# EAGLE schematic tigor_mbed_rev_b_print (EAGLE 6.3)
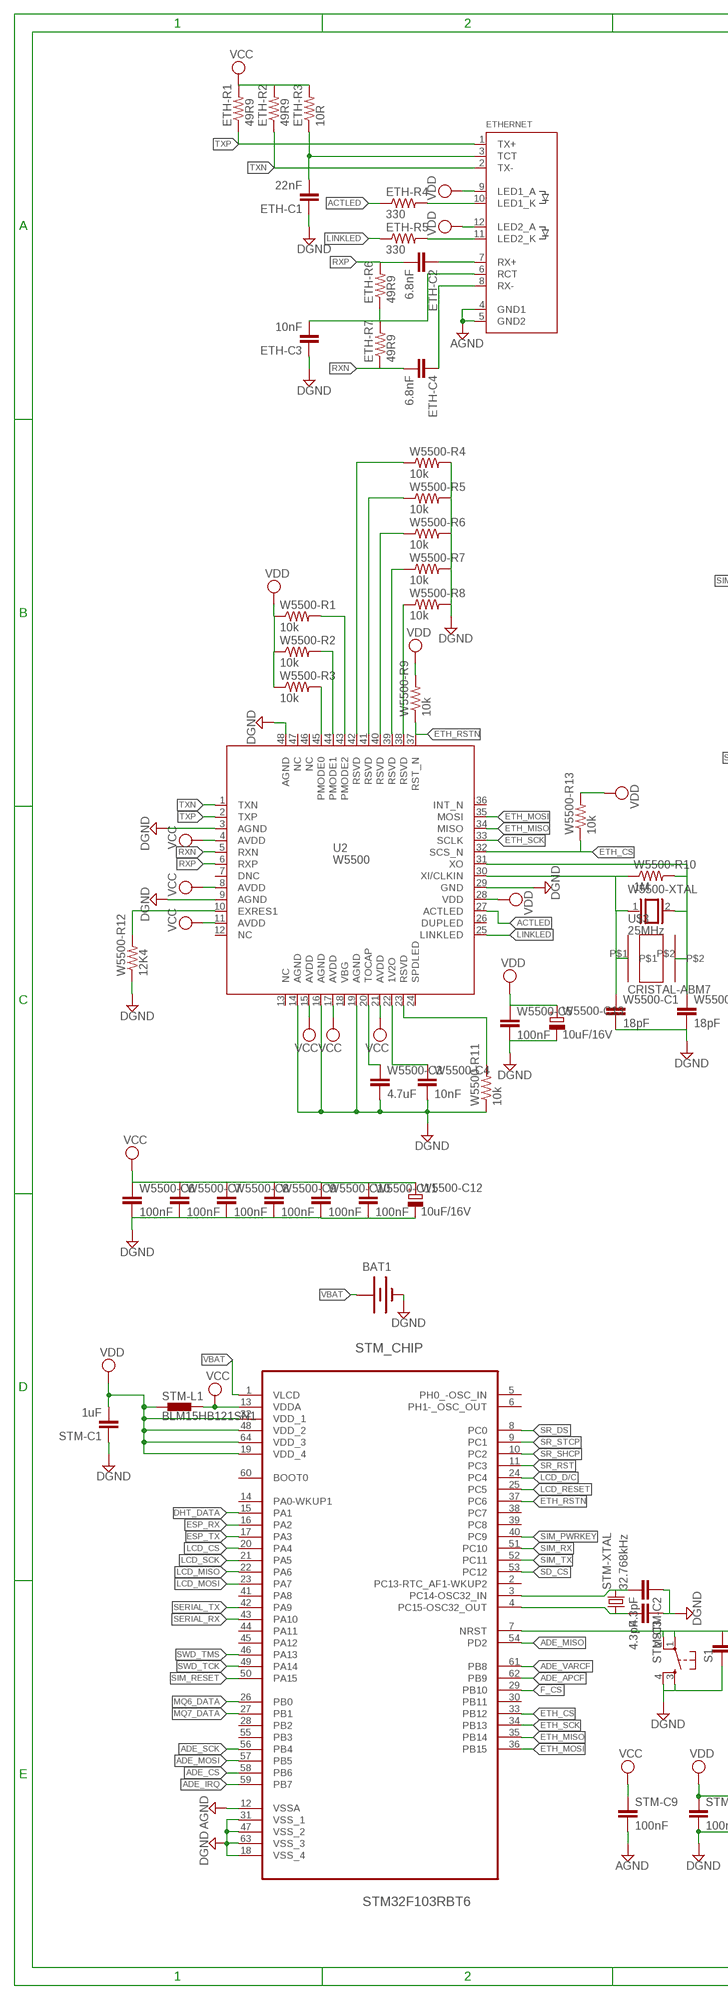
[diagram p0: schematic, sheet 1, part 1 of 2]
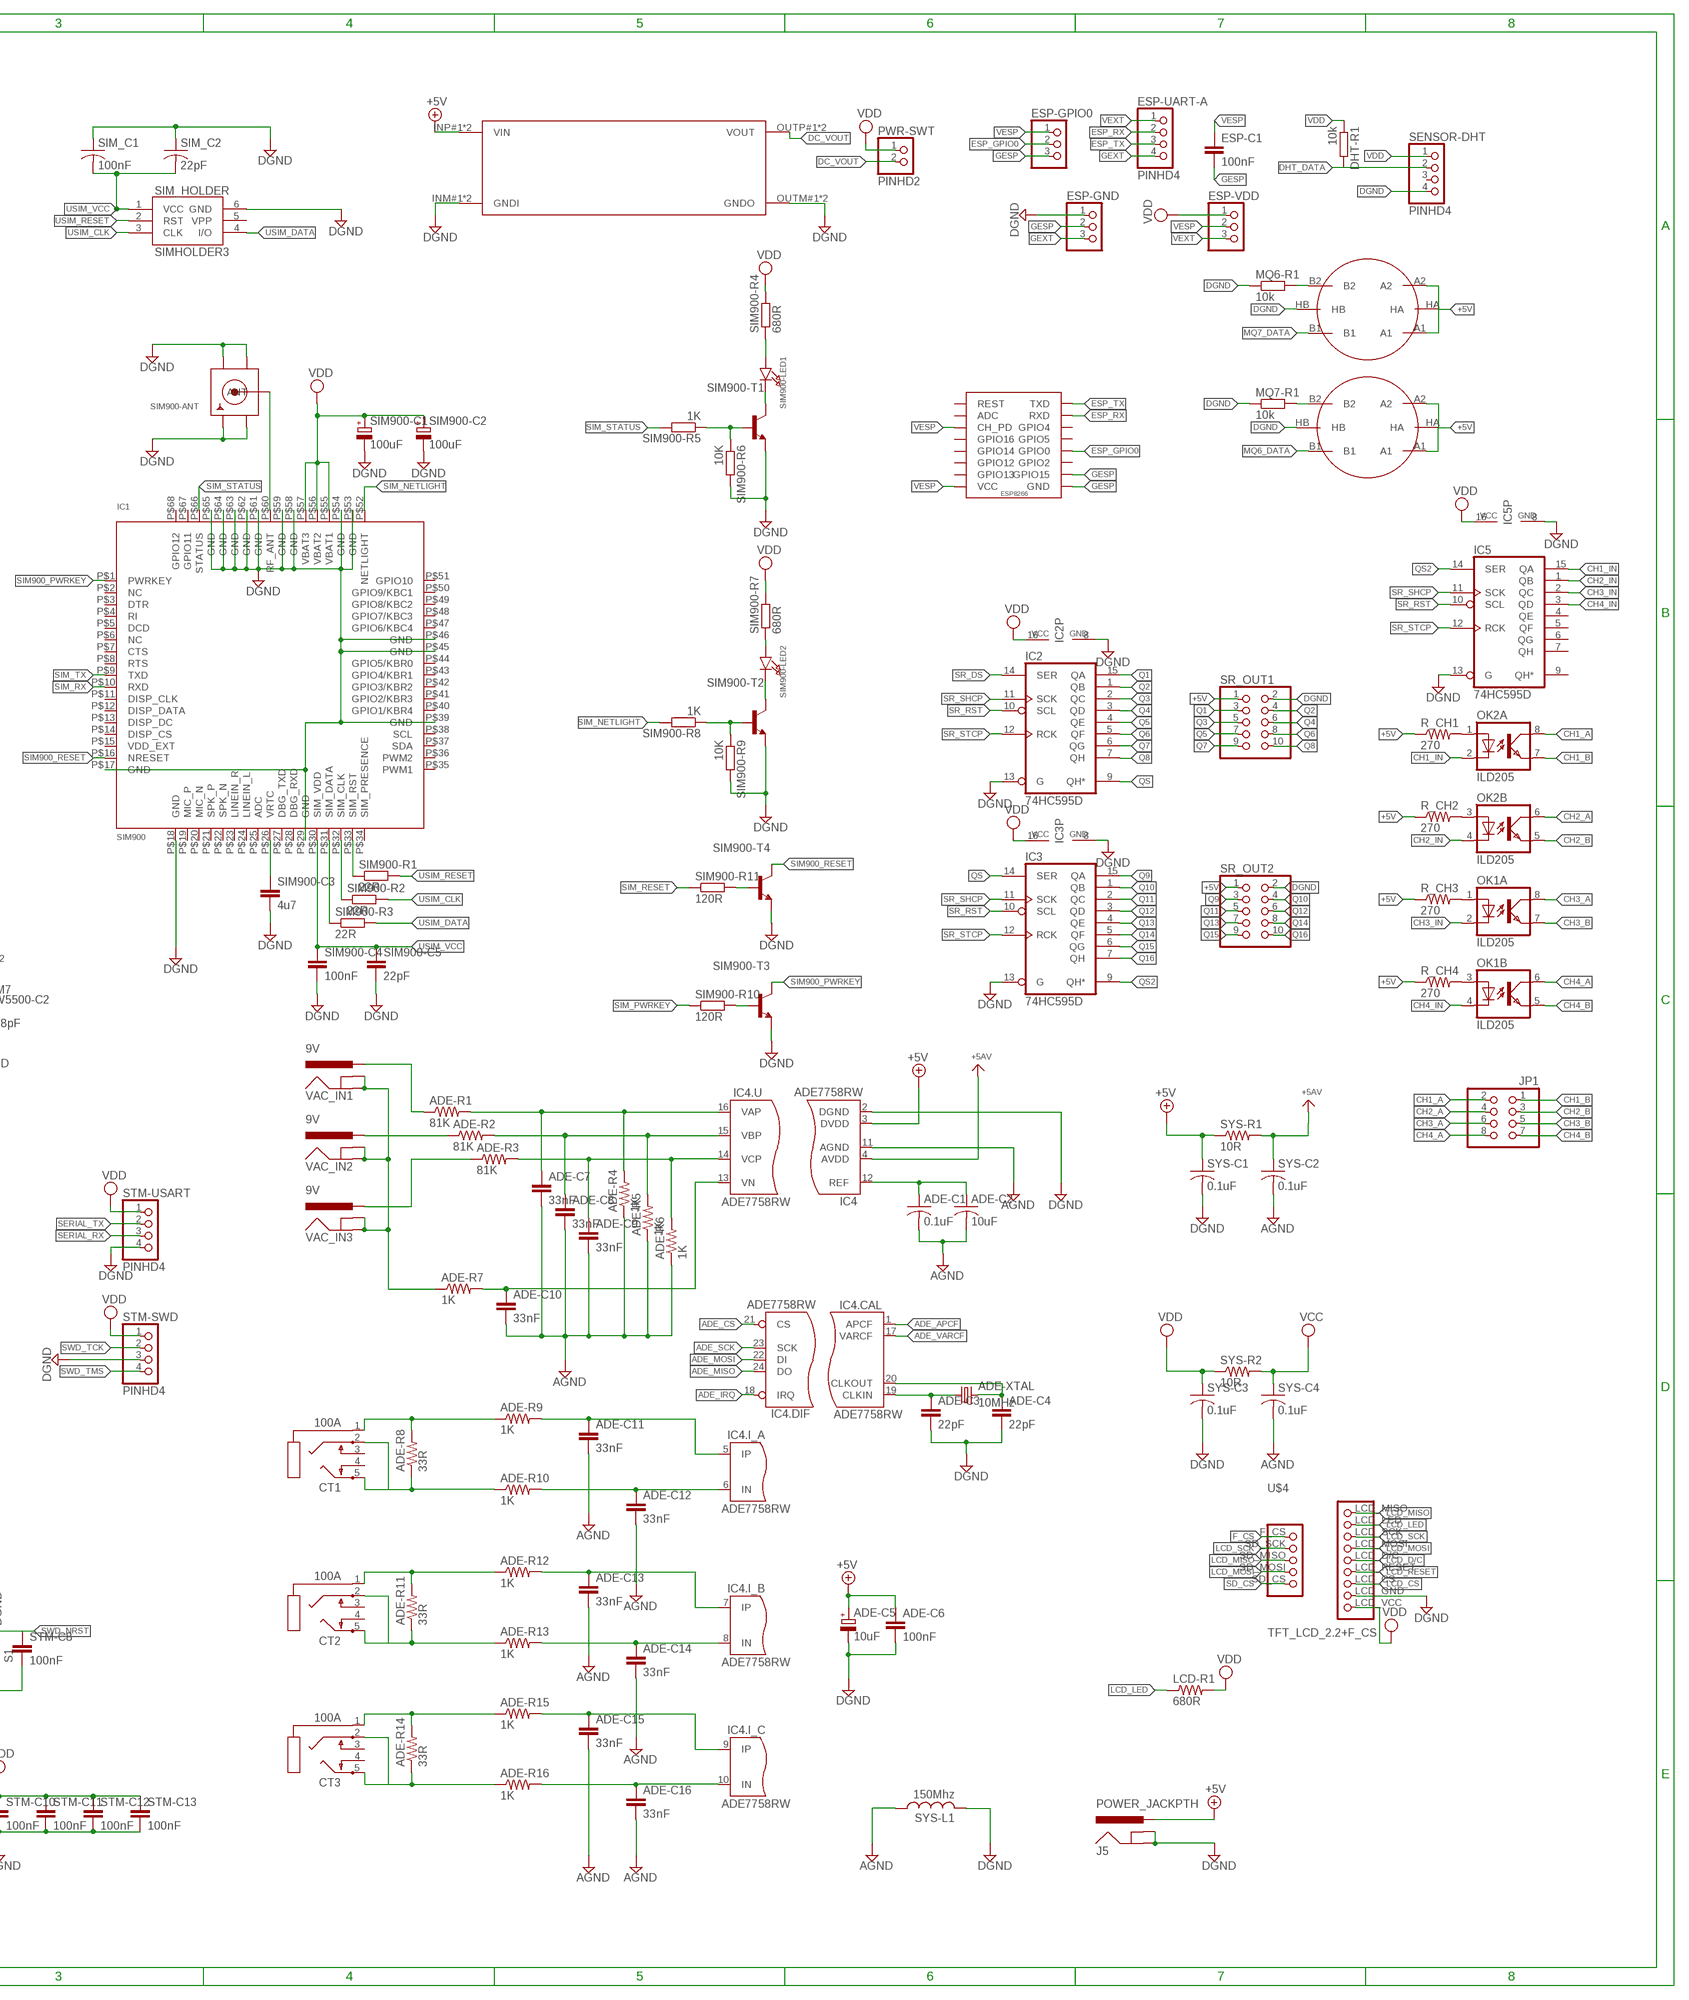
[diagram p1: schematic, sheet 1, part 2 of 2]

## Parts
ADE-C1  0.1uF  C-USC0603  [C0603@1]
ADE-C2  10uF  C-USC0805K  [C0805K]
ADE-C3  22pF  C-EUC0603  [C0603]
ADE-C4  22pF  C-EUC0603  [C0603]
ADE-C5  10uF  CPOL-EU153CLV-0605  [153CLV-0605]
ADE-C6  100nF  C-EUC0603  [C0603]
ADE-C7  33nF  CAP0603-CAP  [0603-CAP]
ADE-C8  33nF  CAP0603-CAP  [0603-CAP]
ADE-C9  33nF  CAP0603-CAP  [0603-CAP]
ADE-C10  33nF  CAP0603-CAP  [0603-CAP]
ADE-C11  33nF  CAP0603-CAP  [0603-CAP]
ADE-C12  33nF  CAP0603-CAP  [0603-CAP]
ADE-C13  33nF  CAP0603-CAP  [0603-CAP]
ADE-C14  33nF  CAP0603-CAP  [0603-CAP]
ADE-C15  33nF  CAP0603-CAP  [0603-CAP]
ADE-C16  33nF  CAP0603-CAP  [0603-CAP]
ADE-R1  81K  RESISTOR0603-RES  [0603-RES]
ADE-R2  81K  RESISTOR0603-RES  [0603-RES]
ADE-R3  81K  RESISTOR0603-RES  [0603-RES]
ADE-R4  1K  RESISTOR0603-RES  [0603-RES]
ADE-R5  1K  RESISTOR0603-RES  [0603-RES]
ADE-R6  1K  RESISTOR0603-RES  [0603-RES]
ADE-R7  1K  RESISTOR0603-RES  [0603-RES]
ADE-R8  33R  RESISTOR0603-RES  [0603-RES]
ADE-R9  1K  RESISTOR0603-RES  [0603-RES]
ADE-R10  1K  RESISTOR0603-RES  [0603-RES]
ADE-R11  33R  RESISTOR0603-RES  [0603-RES]
ADE-R12  1K  RESISTOR0603-RES  [0603-RES]
ADE-R13  1K  RESISTOR0603-RES  [0603-RES]
ADE-R14  33R  RESISTOR0603-RES  [0603-RES]
ADE-R15  1K  RESISTOR0603-RES  [0603-RES]
ADE-R16  1K  RESISTOR0603-RES  [0603-RES]
ADE-XTAL  10MHz  CRYSTALHC49US  [HC49US]
BAT1  BATTERY20PTH  [BATTCOM_20MM_PTH]
CT1  100A  AUDIO_STEREOJACK  [STX3100]
CT2  100A  AUDIO_STEREOJACK  [STX3100]
CT3  100A  AUDIO_STEREOJACK  [STX3100]
DCDC-3.5V  DCDCMODULE_SMALL  [DCDCMODULE-SMALL]
DHT-R1  10k  R-EU_R0603  [R0603]
ESP-C1  100nF  C-EUC0603  [C0603]
ESP-GND  PINHD-1X3  [1X03]
ESP-GPIO0  PINHD-1X3  [1X03]
ESP-UART-A  PINHD4  [PINHD4]
ESP-VDD  PINHD-1X3  [1X03]
ETH-C1  22nF  C-EUC0603  [C0603]
ETH-C2  6.8nF  C-EUC0603  [C0603]
ETH-C3  10nF  C-EUC0603  [C0603]
ETH-C4  6.8nF  C-EUC0603  [C0603]
ETH-R1  49R9  R-US_R0603  [R0603]
ETH-R2  49R9  R-US_R0603  [R0603]
ETH-R3  10R  R-US_R0603  [R0603]
ETH-R4  330  R-US_R0603  [R0603]
ETH-R5  330  R-US_R0603  [R0603]
ETH-R6  49R9  R-US_R0603  [R0603]
ETH-R7  49R9  R-US_R0603  [R0603]
ETHERNET  RJ45J0026D21BNL  [RJ45_PULSEJACK]
IC1  SIM900  GSM_SIM900_LITERAL  [SIM900_SMT]
IC2  74HC595D  [SO16]
IC3  74HC595D  [SO16]
IC4  ADE7758RW  [SOIC24]
IC5  74HC595D  [SO16]
J5  POWER_JACKPTH  [POWER_JACK_PTH]
JP1  PINHD-2X4  [2X04]
LCD-R1  680R  RESISTOR0603-RES  [0603-RES]
MQ6-R1  10k  R-EU_R0603  [R0603]
MQ7-R1  10k  R-EU_R0603  [R0603]
OK1  ILD205  [SOIC08]
OK2  ILD205  [SOIC08]
PWR-SWT  PINHD2  [PINHD2]
R_CH1  270  RESISTOR0603-RES  [0603-RES]
R_CH2  270  RESISTOR0603-RES  [0603-RES]
R_CH3  270  RESISTOR0603-RES  [0603-RES]
R_CH4  270  RESISTOR0603-RES  [0603-RES]
S1  TAC_SWITCHPTH  [TACTILE-PTH]
SENSOR-DHT  PINHD4  [PINHD4]
SENSOR-MQ6  METHANE_SENSOR  [MQ-3]
SENSOR-MQ7  METHANE_SENSOR  [MQ-3]
SIM900-ANT  SMACONNECTOR  [SMA90_DIP]
SIM900-C1  100uF  CPOL-EU153CLV-0605  [153CLV-0605]
SIM900-C2  100uF  CPOL-EU153CLV-0605  [153CLV-0605]
SIM900-C3  4u7  C-EUC0603  [C0603]
SIM900-C4  100nF  C-EUC0603  [C0603]
SIM900-C5  22pF  C-EUC0603  [C0603]
SIM900-LED1  LED0805_NOOUTLINE  [CHIPLED_0805_NOOUTLINE]
SIM900-LED2  LED0805_NOOUTLINE  [CHIPLED_0805_NOOUTLINE]
SIM900-R1  22R  R-EU_R0603  [R0603]
SIM900-R2  22R  R-EU_R0603  [R0603]
SIM900-R3  22R  R-EU_R0603  [R0603]
SIM900-R4  680R  R-EU_R0603  [R0603]
SIM900-R5  1K  R-EU_R0603  [R0603]
SIM900-R6  10K  R-EU_R0603  [R0603]
SIM900-R7  680R  R-EU_R0603  [R0603]
SIM900-R8  1K  R-EU_R0603  [R0603]
SIM900-R9  10K  R-EU_R0603  [R0603]
SIM900-R10  120R  R-EU_R0603  [R0603]
SIM900-R11  120R  R-EU_R0603  [R0603]
SIM900-T1  MMBT2222ALT1-NPN-SOT23-BEC  [SOT23-BEC]
SIM900-T2  MMBT2222ALT1-NPN-SOT23-BEC  [SOT23-BEC]
SIM900-T3  MMBT2222ALT1-NPN-SOT23-BEC  [SOT23-BEC]
SIM900-T4  MMBT2222ALT1-NPN-SOT23-BEC  [SOT23-BEC]
SIM_C1  100nF  C-USC0603K  [C0603K]
SIM_C2  22pF  C-USC0603K  [C0603K]
SIM_HOLDER  SIMHOLDER3  [SIMHOLDER3]
SR_OUT1  PINHD-2X5/90  [2X05/90]
SR_OUT2  PINHD-2X5/90  [2X05/90]
STM-C1  1uF  C-EUC0603  [C0603]
STM-C2  4.3pF  C-EUC0603  [C0603]
STM-C3  4.3pF  C-EUC0603  [C0603]
STM-C8  100nF  C-EUC0603  [C0603]
STM-C9  100nF  C-EUC0603  [C0603]
STM-C10  100nF  C-EUC0603  [C0603]
STM-C11  100nF  C-EUC0603  [C0603]
STM-C12  100nF  C-EUC0603  [C0603]
STM-C13  100nF  C-EUC0603  [C0603]
STM-L1  BLM15HB121SN1  [0402]
STM-SWD  PINHD4  [PINHD4]
STM-USART  PINHD4  [PINHD4]
STM-XTAL  32.768kHz  CRYSTALTC26H  [TC26H]
STM_CHIP  STM32F103RBT6  STM32L152RBT6  [QFP50P1200X1200X160-64N]
SYS-C1  0.1uF  C-USC0603  [C0603@1]
SYS-C2  0.1uF  C-USC0603  [C0603@1]
SYS-C3  0.1uF  C-USC0603  [C0603@1]
SYS-C4  0.1uF  C-USC0603  [C0603@1]
SYS-L1  150Mhz  L-USWE-TPC  [POWER-CHOKE_WE-TPC]
SYS-R1  10R  RESISTOR0603-RES  [0603-RES]
SYS-R2  10R  RESISTOR0603-RES  [0603-RES]
U2  W5500  [W5500]
U$3  CRISTAL-ABM7  [CRISTAL-ABM7]
U$4  TFT_LCD_2.2+F_CS  [TFT_LCD_2.2+F_CS]
U$5  ESP8266WI12  [WI12]
VAC_IN1  9V  POWER_JACKPTH  [POWER_JACK_PTH]
VAC_IN2  9V  POWER_JACKPTH  [POWER_JACK_PTH]
VAC_IN3  9V  POWER_JACKPTH  [POWER_JACK_PTH]
W5500-C1  18pF  C-EUC0603  [C0603]
W5500-C2  18pF  C-EUC0603  [C0603]
W5500-C3  4.7uF  C-EUC0603  [C0603]
W5500-C4  10nF  C-EUC0603  [C0603]
W5500-C5  100nF  C-EUC0603  [C0603]
W5500-C6  100nF  C-EUC0603  [C0603]
W5500-C7  100nF  C-EUC0603  [C0603]
W5500-C8  100nF  C-EUC0603  [C0603]
W5500-C9  100nF  C-EUC0603  [C0603]
W5500-C10  100nF  C-EUC0603  [C0603]
W5500-C11  100nF  C-EUC0603  [C0603]
W5500-C12  10uF/16V  CPOL-EU153CLV-0605  [153CLV-0605]
W5500-C13  10uF/16V  CPOL-EU153CLV-0605  [153CLV-0605]
W5500-R1  10k  R-US_R0603  [R0603]
W5500-R2  10k  R-US_R0603  [R0603]
W5500-R3  10k  R-US_R0603  [R0603]
W5500-R4  10k  R-US_R0603  [R0603]
W5500-R5  10k  R-US_R0603  [R0603]
W5500-R6  10k  R-US_R0603  [R0603]
W5500-R7  10k  R-US_R0603  [R0603]
W5500-R8  10k  R-US_R0603  [R0603]
W5500-R9  10k  R-US_R0603  [R0603]
W5500-R10  1M  R-US_R0603  [R0603]
W5500-R11  10k  R-US_R0603  [R0603]
W5500-R12  12K4  R-US_R0805  [R0805]
W5500-R13  10k  R-US_R0603  [R0603]
W5500-XTAL  25MHz  XTAL/S  [QS]

## Nets
+5V [power]: ADE-C5.+ ADE-C6.1 DCDC-3.5V.INP#1(VIN) DCDC-3.5V.INP#2(VIN) IC4.3(DVDD) J5.PWR R_CH1.1 R_CH2.1 R_CH3.1 R_CH4.1 SENSOR-MQ6.A1 SENSOR-MQ6.A2 SENSOR-MQ6.HA SENSOR-MQ7.A1 SENSOR-MQ7.A2 SENSOR-MQ7.HA SR_OUT1.1 SR_OUT2.1 SYS-C1.1 SYS-R1.1
ACTLED: ETH-R4.1 U2.27(ACTLED)
ADE_APCF: IC4.1(APCF) STM_CHIP.62(PB9)
ADE_CS: IC4.21(CS) STM_CHIP.58(PB6)
ADE_IRQ: IC4.18(IRQ) STM_CHIP.59(PB7)
ADE_MISO: IC4.24(DO) STM_CHIP.54(PD2)
ADE_MOSI: IC4.22(DI) STM_CHIP.57(PB5)
ADE_SCK: IC4.23(SCK) STM_CHIP.56(PB4)
ADE_VARCF: IC4.17(VARCF) STM_CHIP.61(PB8)
AGND: ADE-C1.2 ADE-C2.2 ADE-C7.2 ADE-C8.2 ADE-C9.2 ADE-C10.2 ADE-C11.2 ADE-C12.2 ADE-C13.2 ADE-C14.2 ADE-C15.2 ADE-C16.2 ADE-R4.1 ADE-R5.1 ADE-R6.1 ETHERNET.4(GND1) ETHERNET.5(GND2) IC4.11(AGND) STM-C9.2 STM_CHIP.12(VSSA) SYS-C2.2 SYS-C4.2 SYS-L1.1
AVDD: IC4.4(AVDD) SYS-C2.1 SYS-R1.2 ; supply symbol labelled +5AV
CH1_A: JP1.2 OK2.8(A:COL)
CH1_B: JP1.1 OK2.7(A:EMIT)
CH1_IN: IC5.15(QA) OK2.2(A:C)
CH2_A: JP1.4 OK2.6(B:COL)
CH2_B: JP1.3 OK2.5(B:EMIT)
CH2_IN: IC5.1(QB) OK2.4(B:C)
CH3_A: JP1.6 OK1.8(A:COL)
CH3_B: JP1.5 OK1.7(A:EMIT)
CH3_IN: IC5.2(QC) OK1.2(A:C)
CH4_A: JP1.8 OK1.6(B:COL)
CH4_B: JP1.7 OK1.5(B:EMIT)
CH4_IN: IC5.3(QD) OK1.4(B:C)
DC_VOUT: DCDC-3.5V.OUTP#1(VOUT) DCDC-3.5V.OUTP#2(VOUT) PWR-SWT.2
DGND: ADE-C3.2 ADE-C4.2 ADE-C5.- ADE-C6.2 BAT1.2(-) DCDC-3.5V.INM#1(GNDI) DCDC-3.5V.INM#2(GNDI) DCDC-3.5V.OUTM#1(GNDO) DCDC-3.5V.OUTM#2(GNDO) ESP-GND.1 ETH-C1.1 ETH-C3.1 IC1.P$17(GND) IC1.P$18(GND) IC1.P$29(GND) IC1.P$39(GND) IC1.P$45(GND) IC1.P$46(GND) IC1.P$53(GND) IC1.P$54(GND) IC1.P$58(GND) IC1.P$59(GND) IC1.P$61(GND) IC1.P$62(GND) IC1.P$63(GND) IC1.P$64(GND) IC1.P$65(GND) IC2.8(GND) IC2.13(G) IC3.8(GND) IC3.13(G) IC4.2(DGND) IC5.8(GND) IC5.13(G) J5.GND J5.GNDBREAK MQ6-R1.1 MQ7-R1.1 S1.3 S1.4 SENSOR-DHT.4 SENSOR-MQ6.HB SENSOR-MQ7.HB SIM900-ANT.GND1 SIM900-ANT.GND2 SIM900-ANT.GND3 SIM900-ANT.GND4 SIM900-C1.- SIM900-C2.- SIM900-C3.2 SIM900-C4.2 SIM900-C5.2 SIM900-R6.2 SIM900-R9.2 SIM900-T1.E SIM900-T2.E SIM900-T3.E SIM900-T4.E SIM_C1.1 SIM_C2.1 SIM_HOLDER.6(GND) SR_OUT1.2 SR_OUT2.2 STM-C1.1 STM-C2.1 STM-C3.1 STM-C8.2 STM-C10.2 STM-C11.2 STM-C12.2 STM-C13.2 STM-SWD.3 STM-USART.4 STM_CHIP.18(VSS_4) STM_CHIP.31(VSS_1) STM_CHIP.47(VSS_2) STM_CHIP.63(VSS_3) SYS-C1.2 SYS-C3.2 SYS-L1.2 U2.3(AGND) U2.9(AGND) U2.14(AGND) U2.16(AGND) U2.19(AGND) U2.29(GND) U2.48(AGND) U$4.LCD_GND W5500-C1.2 W5500-C2.2 W5500-C3.2 W5500-C4.2 W5500-C5.2 W5500-C6.2 W5500-C7.2 W5500-C8.2 W5500-C9.2 W5500-C10.2 W5500-C11.2 W5500-C12.- W5500-C13.- W5500-R4.2 W5500-R5.2 W5500-R6.2 W5500-R7.2 W5500-R8.2 W5500-R11.1 W5500-R12.1
DHT_DATA: DHT-R1.2 SENSOR-DHT.2 STM_CHIP.15(PA1)
ESP_GPIO0: ESP-GPIO0.2 U$5.GPIO00(GPIO0)
ESP_RX: ESP-UART-A.2 STM_CHIP.16(PA2) U$5.RXD
ESP_TX: ESP-UART-A.3 STM_CHIP.17(PA3) U$5.TXD
ETH_CS: STM_CHIP.33(PB12) U2.32(SCS_N) W5500-R13.1
ETH_MISO: STM_CHIP.35(PB14) U2.34(MISO)
ETH_MOSI: STM_CHIP.36(PB15) U2.35(MOSI)
ETH_RSTN: STM_CHIP.37(PC6) U2.37(RST_N) W5500-R9.1
ETH_SCK: STM_CHIP.34(PB13) U2.33(SCLK)
F_CS: STM_CHIP.29(PB10) U$4.F_CS
GESP: ESP-C1.2 ESP-GND.2 ESP-GPIO0.3 U$5.GND U$5.GPIO15
GEXT: ESP-GND.3 ESP-UART-A.4
IBN: ADE-R11.1 ADE-R13.1 CT2.2 CT2.5
ICN: ADE-R14.1 ADE-R16.1 CT3.2 CT3.5
LCD_CS: STM_CHIP.20(PA4) U$4.LCD_CS
LCD_D/C: STM_CHIP.24(PC4) U$4.LCD_D/C
LCD_LED: LCD-R1.1 U$4.LCD_LED
LCD_MISO: STM_CHIP.22(PA6) U$4.LCD_MISO U$4.SD_MISO
LCD_MOSI: STM_CHIP.23(PA7) U$4.LCD_MOSI U$4.SD_MOSI
LCD_RESET: STM_CHIP.25(PC5) U$4.LCD_RESET
LCD_SCK: STM_CHIP.21(PA5) U$4.LCD_SCK U$4.SD_SCK
LINKLED: ETH-R5.1 U2.25(LINKLED)
MQ6_DATA: SENSOR-MQ7.B1 STM_CHIP.26(PB0)
MQ7_DATA: SENSOR-MQ6.B1 STM_CHIP.27(PB1)
N$1: STM-C2.2 STM-XTAL.2 STM_CHIP.3(PC14-OSC32_IN)
N$2: STM-C3.2 STM-XTAL.1 STM_CHIP.4(PC15-OSC32_OUT)
N$3: IC1.P$31(SIM_DATA) SIM900-R3.1
N$5: OK2.1(A:A) R_CH1.2
N$6: OK2.3(B:A) R_CH2.2
N$7: OK1.1(A:A) R_CH3.2
N$8: IC1.P$32(SIM_CLK) SIM900-R2.1
N$9: MQ6-R1.2 SENSOR-MQ6.B2
N$10: ADE-C9.1 ADE-R3.2 ADE-R6.2 IC4.14(VCP)
N$11: ETH-R4.2 ETHERNET.10(LED1_K)
N$12: ETH-R5.2 ETHERNET.11(LED2_K)
N$13: IC1.P$33(SIM_RST) SIM900-R1.1
N$14: IC1.P$26(VRTC) SIM900-C3.1
N$15: IC1.P$60(RF_ANT) SIM900-ANT.ANTENNA(ANT)
N$16: SIM900-LED1.A SIM900-R4.1
N$17: SIM900-LED1.C SIM900-T1.C
N$18: SIM900-R5.1 SIM900-R6.1 SIM900-T1.B
N$19: SIM900-LED2.A SIM900-R7.1
N$20: SIM900-LED2.C SIM900-T2.C
N$21: SIM900-R8.1 SIM900-R9.1 SIM900-T2.B
N$22: ETH-C2.1 ETHERNET.7(RX+)
N$23: ETH-C1.2 ETH-R3.1 ETHERNET.3(TCT)
N$24: ADE-C15.1 ADE-R15.2 IC4.9(IP)
N$25: ADE-R11.2 ADE-R12.1 CT2.1
N$26: ETH-C4.1 ETHERNET.8(RX-)
N$27: ADE-C11.1 ADE-R9.2 IC4.5(IP)
N$28: ADE-C12.1 ADE-R10.2 IC4.6(IN)
N$29: ETH-C3.2 ETH-R6.1 ETH-R7.2 ETHERNET.6(RCT)
N$30: ADE-C14.1 ADE-R13.2 IC4.8(IN)
N$31: ADE-C13.1 ADE-R12.2 IC4.7(IP)
N$32: ADE-C1.1 ADE-C2.1 IC4.12(REF)
N$33: ADE-C3.1 ADE-XTAL.1 IC4.19(CLKIN)
N$34: ADE-C4.1 ADE-XTAL.2 IC4.20(CLKOUT)
N$35: ADE-C10.1 ADE-R7.2 IC4.13(VN)
N$36: ADE-R2.1 VAC_IN2.PWR
N$37: ADE-C8.1 ADE-R2.2 ADE-R5.2 IC4.15(VBP)
N$38: U2.20(TOCAP) W5500-C3.1
N$39: ADE-R8.2 ADE-R9.1 CT1.1
N$40: ADE-C16.1 ADE-R16.2 IC4.10(IN)
N$41: U2.22(1V2O) W5500-C4.1
N$42: U2.23(RSVD) W5500-R11.2
N$43: MQ7-R1.2 SENSOR-MQ7.B2
N$44: SIM900-R10.2 SIM900-T3.B
N$45: SIM900-R11.2 SIM900-T4.B
N$46: OK1.3(B:A) R_CH4.2
N$47: ADE-R8.1 ADE-R10.1 CT1.2 CT1.5
N$48: ADE-R14.2 ADE-R15.1 CT3.1
N$50: U2.31(XO) U$3.P$2 W5500-C2.1 W5500-R10.2 W5500-XTAL.2
N$51: U2.10(EXRES1) W5500-R12.2
N$52: ADE-C7.1 ADE-R1.2 ADE-R4.2 IC4.16(VAP)
N$54: ADE-R1.1 VAC_IN1.PWR
N$55: ADE-R7.1 VAC_IN1.GND VAC_IN1.GNDBREAK VAC_IN2.GND VAC_IN2.GNDBREAK VAC_IN3.GND VAC_IN3.GNDBREAK
N$57: U2.38(RSVD) W5500-R8.1
N$58: U2.39(RSVD) W5500-R7.1
N$59: U2.40(RSVD) W5500-R6.1
N$60: U2.41(RSVD) W5500-R5.1
N$61: U2.42(RSVD) W5500-R4.1
N$62: U2.43(PMODE2) W5500-R1.2
N$63: U2.44(PMODE1) W5500-R2.2
N$64: U2.45(PMODE0) W5500-R3.2
N$65: ADE-R3.1 VAC_IN3.PWR
N$66: U2.30(XI/CLKIN) U$3.P$1 W5500-C1.1 W5500-R10.1 W5500-XTAL.1
Q1: IC2.15(QA) SR_OUT1.3
Q2: IC2.1(QB) SR_OUT1.4
Q3: IC2.2(QC) SR_OUT1.5
Q4: IC2.3(QD) SR_OUT1.6
Q5: IC2.4(QE) SR_OUT1.7
Q6: IC2.5(QF) SR_OUT1.8
Q7: IC2.6(QG) SR_OUT1.9
Q8: IC2.7(QH) SR_OUT1.10
Q9: IC3.15(QA) SR_OUT2.3
Q10: IC3.1(QB) SR_OUT2.4
Q11: IC3.2(QC) SR_OUT2.5
Q12: IC3.3(QD) SR_OUT2.6
Q13: IC3.4(QE) SR_OUT2.7
Q14: IC3.5(QF) SR_OUT2.8
Q15: IC3.6(QG) SR_OUT2.9
Q16: IC3.7(QH) SR_OUT2.10
QS: IC2.9(QH*) IC3.14(SER)
QS2: IC3.9(QH*) IC5.14(SER)
RXN: ETH-C4.2 ETH-R7.1 U2.5(RXN)
RXP: ETH-C2.2 ETH-R6.2 U2.6(RXP)
SD_CS: STM_CHIP.53(PC12) U$4.SD_CS
SERIAL_RX: STM-USART.3 STM_CHIP.43(PA10)
SERIAL_TX: STM-USART.2 STM_CHIP.42(PA9)
SIM900_PWRKEY: IC1.P$1(PWRKEY) SIM900-T3.C
SIM900_RESET: IC1.P$16(NRESET) SIM900-T4.C
SIM_NETLIGHT: IC1.P$52(NETLIGHT) SIM900-R8.2
SIM_PWRKEY: SIM900-R10.1 STM_CHIP.40(PC9)
SIM_RESET: SIM900-R11.1 STM_CHIP.50(PA15)
SIM_RX: IC1.P$10(RXD) STM_CHIP.51(PC10)
SIM_STATUS: IC1.P$66(STATUS) SIM900-R5.2
SIM_TX: IC1.P$9(TXD) STM_CHIP.52(PC11)
SR_DS: IC2.14(SER) STM_CHIP.8(PC0)
SR_RST: IC2.10(SCL) IC3.10(SCL) IC5.10(SCL) STM_CHIP.11(PC3)
SR_SHCP: IC2.11(SCK) IC3.11(SCK) IC5.11(SCK) STM_CHIP.10(PC2)
SR_STCP: IC2.12(RCK) IC3.12(RCK) IC5.12(RCK) STM_CHIP.9(PC1)
SWD_NRST: S1.1 S1.2 STM-C8.1 STM_CHIP.7(NRST)
SWD_TCK: STM-SWD.2 STM_CHIP.49(PA14)
SWD_TMS: STM-SWD.4 STM_CHIP.46(PA13)
TXN: ETH-R2.1 ETHERNET.2(TX-) U2.1(TXN)
TXP: ETH-R1.1 ETHERNET.1(TX+) U2.2(TXP)
USIM_CLK: SIM900-R2.2 SIM_HOLDER.3(CLK)
USIM_DATA: SIM900-R3.2 SIM_HOLDER.4(I/O)
USIM_RESET: SIM900-R1.2 SIM_HOLDER.2(RST)
USIM_VCC: IC1.P$30(SIM_VDD) SIM900-C4.1 SIM900-C5.1 SIM_C1.2 SIM_C2.2 SIM_HOLDER.1(VCC)
VBAT: BAT1.1(+) STM_CHIP.1(VLCD)
VCC: ETH-R1.2 ETH-R2.2 ETH-R3.2 STM-C9.1 STM-L1.2 STM_CHIP.13(VDDA) SYS-C4.1 SYS-R2.2 U2.4(AVDD) U2.8(AVDD) U2.11(AVDD) U2.15(AVDD) U2.17(AVDD) U2.21(AVDD) W5500-C6.1 W5500-C7.1 W5500-C8.1 W5500-C9.1 W5500-C10.1 W5500-C11.1 W5500-C12.+
VDD: DHT-R1.1 ESP-VDD.1 ETHERNET.9(LED1_A) ETHERNET.12(LED2_A) IC1.P$55(VBAT1) IC1.P$56(VBAT2) IC1.P$57(VBAT3) IC2.16(VCC) IC3.16(VCC) IC5.16(VCC) LCD-R1.2 PWR-SWT.1 SENSOR-DHT.1 SIM900-C1.+ SIM900-C2.+ SIM900-R4.2 SIM900-R7.2 STM-C1.2 STM-C10.1 STM-C11.1 STM-C12.1 STM-C13.1 STM-L1.1 STM-SWD.1 STM-USART.1 STM_CHIP.19(VDD_4) STM_CHIP.32(VDD_1) STM_CHIP.48(VDD_2) STM_CHIP.64(VDD_3) SYS-C3.1 SYS-R2.1 U2.28(VDD) U$4.LCD_VCC W5500-C5.1 W5500-C13.+ W5500-R1.1 W5500-R2.1 W5500-R3.1 W5500-R9.2 W5500-R13.2
VESP: ESP-C1.1 ESP-GPIO0.1 ESP-VDD.2 U$5.CH_PD U$5.VCC
VEXT: ESP-UART-A.1 ESP-VDD.3
Unconnected: CT1.3 CT1.4 CT2.3 CT2.4 CT3.3 CT3.4 IC1.P$2(NC) IC1.P$3(DTR) IC1.P$4(RI) IC1.P$5(DCD) IC1.P$6(NC) IC1.P$7(CTS) IC1.P$8(RTS) IC1.P$11(DISP_CLK) IC1.P$12(DISP_DATA) IC1.P$13(DISP_DC) IC1.P$14(DISP_CS) IC1.P$15(VDD_EXT) IC1.P$19(MIC_P) IC1.P$20(MIC_N) IC1.P$21(SPK_P) IC1.P$22(SPK_N) IC1.P$23(LINEIN_R) IC1.P$24(LINEIN_L) IC1.P$25(ADC) IC1.P$27(DBG_TXD) IC1.P$28(DBG_RXD) IC1.P$34(SIM_PRESENCE) IC1.P$35(PWM1) IC1.P$36(PWM2) IC1.P$37(SDA) IC1.P$38(SCL) IC1.P$40(GPIO1/KBR4) IC1.P$41(GPIO2/KBR3) IC1.P$42(GPIO3/KBR2) IC1.P$43(GPIO4/KBR1) IC1.P$44(GPIO5/KBR0) IC1.P$47(GPIO6/KBC4) IC1.P$48(GPIO7/KBC3) IC1.P$49(GPIO8/KBC2) IC1.P$50(GPIO9/KBC1) IC1.P$51(GPIO10) IC5.4(QE) IC5.5(QF) IC5.6(QG) IC5.7(QH) IC5.9(QH*) SENSOR-DHT.3 SIM_HOLDER.5(VPP) STM_CHIP.2(PC13-RTC_AF1-WKUP2) STM_CHIP.5(PH0_-OSC_IN) STM_CHIP.6(PH1-_OSC_OUT) STM_CHIP.14(PA0-WKUP1) STM_CHIP.28(PB2) STM_CHIP.30(PB11) STM_CHIP.38(PC7) STM_CHIP.39(PC8) STM_CHIP.41(PA8) STM_CHIP.44(PA11) STM_CHIP.45(PA12) STM_CHIP.55(PB3) STM_CHIP.60(BOOT0) U2.7(DNC) U2.12(NC) U2.13(NC) U2.18(VBG) U2.24(SPDLED) U2.26(DUPLED) U2.36(INT_N) U2.46(NC) U2.47(NC) U$5.ADC U$5.GPIO02(GPIO2) U$5.GPIO04(GPIO4) U$5.GPIO05(GPIO5) U$5.GPIO12 U$5.GPIO13 U$5.GPIO14 U$5.GPIO16 U$5.REST

## Power pins joined to a net without a drawn wire
GPIO11: IC1.P$67(GPIO11)
GPIO12: IC1.P$68(GPIO12)

## Library data of the parts
ADE-C1 ADE-C2 SIM_C1 SIM_C2 SYS-C1-SYS-C4 = rcl:C-US: CAPACITOR, American symbol
ADE-C3 ADE-C4 ADE-C6 ESP-C1 ETH-C1-ETH-C4 SIM900-C3-SIM900-C5 STM-C1-STM-C3 STM-C8-STM-C13 W5500-C1-W5500-C11 = rcl:C-EU: CAPACITOR, European symbol
ADE-C5 SIM900-C1 SIM900-C2 W5500-C12 W5500-C13 = rcl:CPOL-EU: POLARIZED CAPACITOR, European symbol
ADE-C7-ADE-C16 = SparkFun-Passives:CAP: Capacitor Standard 0603 ceramic capacitor, and 0.1" leaded capacitor.
ADE-R1-ADE-R16 LCD-R1 R_CH1-R_CH4 SYS-R1 SYS-R2 = SparkFun-Passives:RESISTOR: Resistor Basic schematic elements and footprints for 0603, 1206, and PTH resistors.
ADE-XTAL STM-XTAL = SparkFun-FreqCtrl:CRYSTAL: Various standard crystals. Proven footprints. Spark Fun Electronics SKU : COM-00534
BAT1 = SparkFun-Electromechanical:BATTERY: Battery Holders Various common sizes : AA, AAA, 20mm coin cell and 12mm coin cell. 20MM_4LEGS, BATT-10373
CT1-CT3 = microbuilder:AUDIO_STEREOJACK: MIC/HEADPHONE JACK Stereo jack with two switches. Kycon STX3100, CUI SJ1-3555NG and/or 4UCon 05544 Digikey: CP1-3555NG-ND Shamelessly taken from the Adafruit Eagle library (public domain) ... thanks! These are normally connected as follows, from right-to-left on the schematic symbol above: Tip: Left Audio Inner Ring: Right Audio Shell: Common/GND
DCDC-3.5V = bontor:DCDCMODULE_SMALL
DHT-R1 MQ6-R1 MQ7-R1 SIM900-R10 SIM900-R11 = resistor:R-EU_: RESISTOR, European symbol
ESP-GND ESP-GPIO0 ESP-VDD = adafruit:PINHD-1X3: PIN HEADER
ESP-UART-A SENSOR-DHT STM-SWD STM-USART = TFT_LCD_2.2:PINHD4: Pin Head 1x4 Holes 2.54 mm
ETH-R1-ETH-R7 W5500-R1-W5500-R13 = resistor:R-US_: RESISTOR, American symbol
ETHERNET = microbuilder:RJ45: RJ45 (Ethernet) Connectors J0026D21BNL - RJ45 Connector with internal transformer and 2 LEDs (Yellow/Green). LEDs have max foreward-voltage of 2.5V. LEDs require an external resistor. Digikey: 553-1349-ND J00-0065NL - RJ45 Connector with internal transformer and 2 LEDs (Yellow/Green). LEDs have max foreward-voltage of 2.5V. LEDs require an external resistor. Digikey: 553-1345-ND
IC1 = microbuilder:GSM_SIM900_LITERAL: SIM900 Quad-Band GSM/GPRS Module Power Supply: 3.2-4.8V Temperature Range: -30°C-+80°C Bands: GSM 850, EGSM 900, DCS 1800, PCS 1900
IC2 IC3 IC5 = 74xx-eu:74*595: 8-bit SHIFT REGISTER, output latch
IC4 = ade7758:ADE7758: Poly Phase Multifunction Energy Metering IC with Per Phase Information FEATURES Highly accurate; supports IEC 60687, IEC 61036, IEC 61268, IEC 62053-21, IEC 62053-22, and IEC 62053-23 Compatible with 3-phase/3-wire, 3-phase/4-wire, and other 3-phase services Less than 0.1% active energy error over a dynamic range of 1000 to 1 at 25°C Supplies active/reactive/apparent energy, voltage rms, current rms, and sampled waveform data Two pulse outputs, one for active power and the other selectable between reactive and apparent power with programmable frequency Digital power, phase, and rms offset calibration On-chip, user-programmable thresholds for line voltage SAG and overvoltage detections An on-chip, digital integrator enables direct interface-to-current sensors with di/dt output A PGA in the current channel allows direct interface to shunts and current transformers An SPI®-compatible serial interface with IRQ Proprietary ADCs and DSP provide high accuracy over large variations in environmental conditions and time Reference 2.4 V (drift 30 ppm/°C typical) with external overdrive capability Single 5 V supply, low power (70 mW typical)
J5 VAC_IN1-VAC_IN3 = SparkFun-Connectors:POWER_JACK: Power Jack This is the standard 5.5mm barrel jack for power. The PTH is the most common, proven, reliable, footprint. The Slot footprint only works if the mill layer is transmitted to the PCB fab house so be warned. Mating wall wart : TOL-00298 (and others); PROD_ID: CONN-08197
JP1 = pinhead:PINHD-2X4: PIN HEADER
OK1 OK2 = optocoupler:ILD2*: Siemens ILD205/206/207/211/213/217 DUAL PHOTOTRANSISTOR SMALL OUTLINE SURFACE MOUNT OPTOCOUPLER Source: 153385-da-01-en-Optocoupler_ILD205-T.pdf; MF: VISHAY/TELEFUNKEN; MPN: ILD205T; OC_FARNELL: 1469512; OC_NEWARK: 20H8678
PWR-SWT = TFT_LCD_2.2:PINHD2: Pin Head 1x2 Holes 2.54 mm
S1 = SparkFun-Electromechanical:TAC_SWITCH: Momentary Switch Button commonly used for reset or general input. Spark Fun Electronics SKU : COM-00097 SMT- SWCH-08247
SENSOR-MQ6 SENSOR-MQ7 = SparkFun-Sensors:METHANE_SENSOR: MQ-4 Methane Gas Sensor SEN-09404
SIM900-ANT = microbuilder:SMACONNECTOR: SMA Connector 90° DIP SMA Connector, 50 Ohm (4UConnector: 07259)
SIM900-LED1 SIM900-LED2 = microbuilder:LED: LED 0603 - 0603 Surface Mount Package 2mA: Green LED - Low Power (3.9mcd, 2ma, 1.7Vf) - Digikey: 475-2709-2-ND Orange LED - Low Power (9.8mcd, 2ma, 1.8Vf) - Digikey: 475-1194-2-ND Red LED - Low Power (5mcd, 2ma, 1.8Vf) - Digikey: 475-1195-2-ND Yellow LED - Low Power (7mcd, 2ma, 1.8Vf) - Digikey: 475-1196-2-ND 5mA: Blue LED - Low Power (17mcd, 5ma, 2.9Vf) - Digikey: LNJ937W8CRACT-ND 0805 - 0805 Surface Mount Package 2mA: Red LED (8.8mcd, 2mA, 1.8Vf, Clear) - Low Power [Digikey: 475-2510-1-ND] Green LED (5mcd, 2mA, 1.8Vf, Clear) - Low Power [Digikey: 475-2730-1-ND] Yellow LED (11.3mcd, 2mA, 1.8Vf, Clear) - Low Power [Digikey: 475-2555-1-ND] 20mA: Red LED (104mcd, 20mA, Diffused) - LS R976 [Digikey: 475-1278-6-ND] Red LED (12mcd, 20mA, 2.0Vf, Clear) - APT2012EC [Digikey: 754-1128-1-ND] Green LED (15mcd, 20mA, 2.2Vf, Clear) - APT2012GC [Digikey: 754-1131-1-ND] Orange LED (160mcd, 20mA, 2.1Vf, Clear) - APT2012SECK [Digikey: 754-1130-1-ND] 1206 - 1206 Surface Mount Package Green LED (26mcd, 20mA, Diffused) - LG N971 [Digikey: 475-1407-6-ND] Red LED (15mcd, 20mA, Diffused) - LH N974 [Digikey: 475-1416-6-ND]
SIM900-R1-SIM900-R9 = rcl:R-EU_: RESISTOR, European symbol
SIM900-T1 SIM900-T2 = transistor:*-NPN-: NPN Transistror BF959 corrected 2008.03.06
SIM900-T3 SIM900-T4 = transistor-neu-to92:*-NPN-: NPN Transistror BF959 corrected 2008.03.06
SIM_HOLDER = SparkFun:SIMHOLDER3
SR_OUT1 SR_OUT2 = pinhead:PINHD-2X5: PIN HEADER
STM-L1 = inductors:BLM15H: EMIFIL (R) Chip Ferrite Bead for GHz Noise Source: http://www.murata.com/ Ferrite Bead BLM15H.pdf
STM_CHIP = ST Microelctronics_By_element14_Batch_1:STM32L152RBT6: Ultralow power ARM-based 32-bit MCU; MPN: STM32L152RBT6; OC_FARNELL: 2060946; OC_NEWARK: 65T3806; PACKAGE: QTP-64; SUPPLIER: STMICROELECTRONICS
SYS-L1 = rcl:L-US: INDUCTOR, American symbol
U2 = W5500:W5500
U$3 = cristal:CRISTAL-ABM7
U$4 = TFT_LCD_2.2:TFT_LCD_2.2+F_CS: TFT LCD ILI9341 with F_CS
U$5 = esp8266:ESP8266
W5500-XTAL = special:XTAL/S: CRYSTAL

## Net classes
1 power: width 0.305 mm, drill 0.6 mm, clearance 0.254 mm
2 gnd: width 0.254 mm, drill 0.6 mm, clearance 0.254 mm